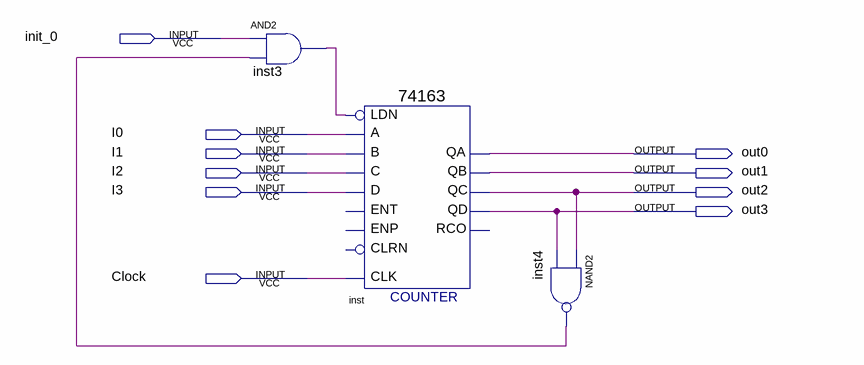
[diagram p0: schematic sheet]
// Quartus schematic SpecialCount4_12.bdf as structural Verilog: 3 symbols, 10 pins
module SpecialCount4_12 (
  input  init_0,
  input  I0,
  input  I1,
  input  I2,
  input  I3,
  input  Clock,
  output out0,
  output out1,
  output out2,
  output out3
);

  wire inst3_out, inst4_out;

  and inst3 (inst3_out, init_0, inst4_out);
  \74163  inst (
    .C(I2), .B(I1), .A(I0), .D(I3), .CLK(Clock), .LDN(inst3_out), .QA(out0), .QB(out1), .QC(out2), .QD(out3));  // open: ENT, CLRN, ENP, RCO
  nand inst4 (inst4_out, out2, out3);
endmodule
